# Altium schematic sheet PyNab_Motor&Encoders.SchDoc: PyNab - Motor & Ear Encoders
size A4; CompanyName: Enero; DrawnBy: Enero; Engineer: Hugo Balette-pape; Organization: ENERO; Address1: 7, rue ambroise thomas; Address2: 75009; Address3: Paris; Address4: France; Revision: 2.0; SheetNumber: 4; SheetTotal: 4
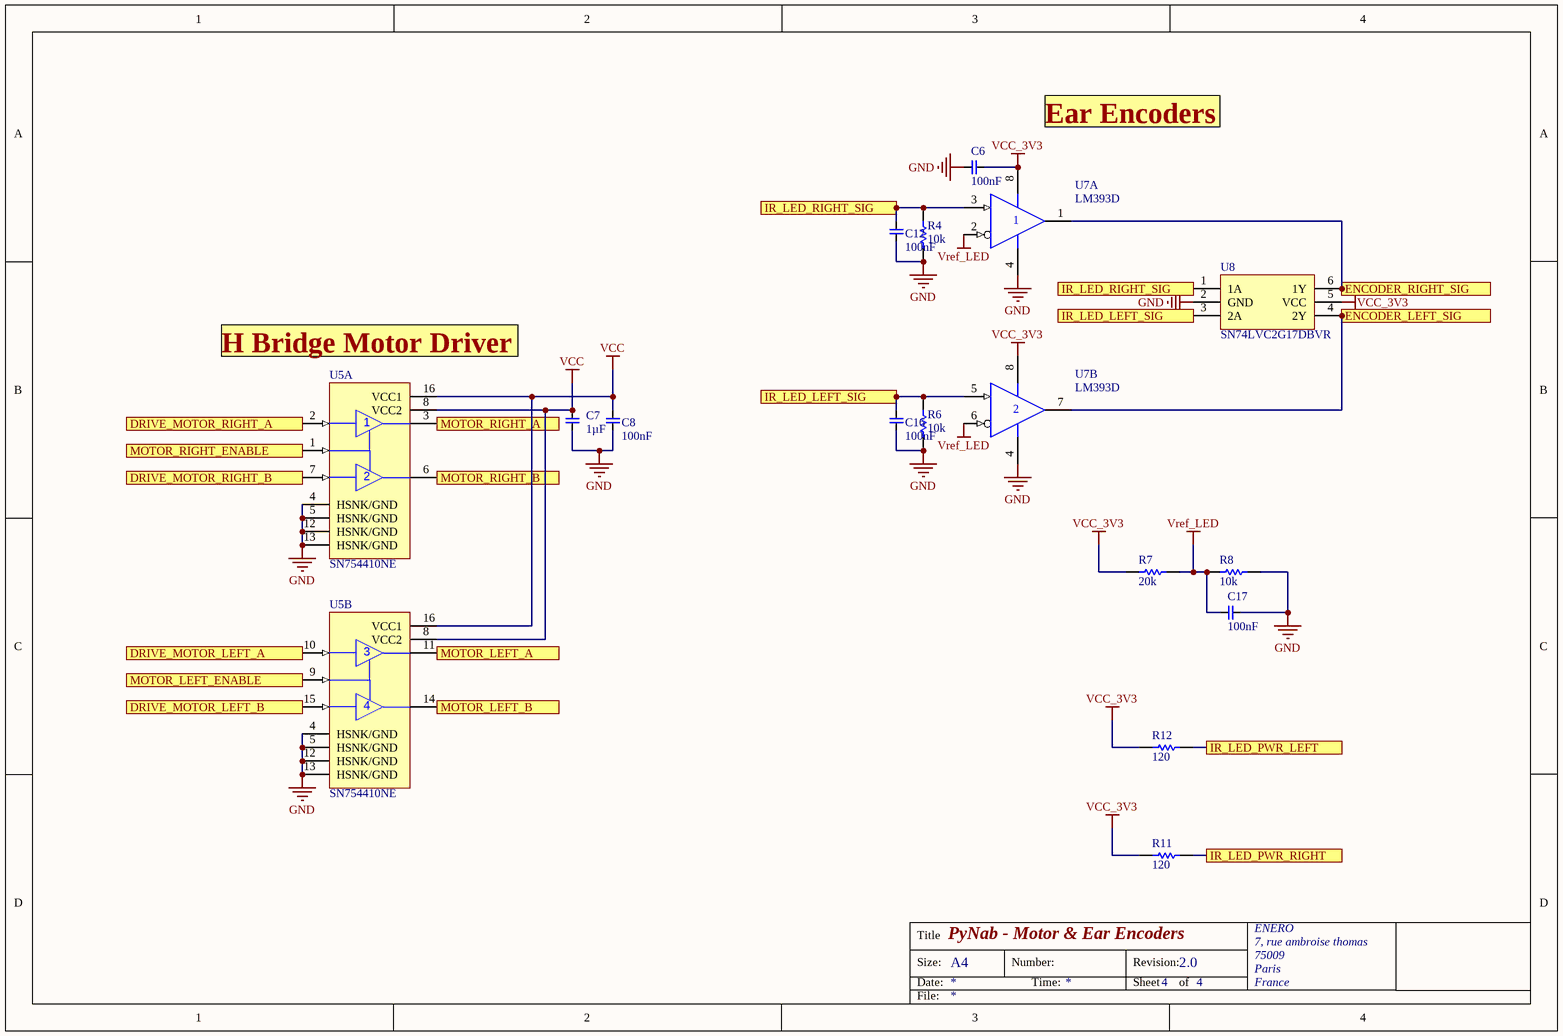
[diagram p0: PyNab_Motor&Encoders.SchDoc]

## Parts
C6  100nF  [CAP0603]
C7  1µF  [CAP0603]
C8  100nF  [CAP0603]
C12  100nF  [CAP0603]
C16  100nF  [CAP0603]
C17  100nF  [CAP0603]
R4  10k  [RES0603]
R6  10k  [RES0603]
R7  20k  [RES0603]
R8  10k  [RES0603]
R11  120  [RES0603]
R12  120  [RES0603]
U5  SN754410NE  [DIP16_traversant_support]  (parts A,B of 2)
U7  LM393D  [D008_N]  (parts A,B of 2)
U8  SN74LVC2G17DBVR  [SN74LVC2G17DBVR]

## Ports
DRIVE_MOTOR_LEFT_A, DRIVE_MOTOR_LEFT_B, DRIVE_MOTOR_RIGHT_A, DRIVE_MOTOR_RIGHT_B, ENCODER_LEFT_SIG, ENCODER_RIGHT_SIG, IR_LED_LEFT_SIG, IR_LED_PWR_LEFT, IR_LED_PWR_RIGHT, IR_LED_RIGHT_SIG, MOTOR_LEFT_A, MOTOR_LEFT_B, MOTOR_LEFT_ENABLE, MOTOR_RIGHT_A, MOTOR_RIGHT_B, MOTOR_RIGHT_ENABLE

## Nets
GND: C6.2 C7.1 C8.1 C12.1 C16.1 C17.2 R4.1 R6.1 R8.2 U5.4(HSNK/GND) U5.5(HSNK/GND) U5.12(HSNK/GND) U5.13(HSNK/GND) U7.4(GND) U8.2(GND)
VCC: C7.2 C8.2 U5.8(VCC2) U5.16(VCC1)
VCC_3V3: C6.1 R7.1 R11.1 R12.1 U7.8(VCC) U8.5(VCC)
Vref_LED: C17.1 R7.2 R8.1 U7.2(IN-) U7.6(IN-)
DRIVE_MOTOR_LEFT_A: U5.10(3A) ; port DRIVE_MOTOR_LEFT_A
DRIVE_MOTOR_LEFT_B: U5.15(4A) ; port DRIVE_MOTOR_LEFT_B
DRIVE_MOTOR_RIGHT_A: U5.2(1A) ; port DRIVE_MOTOR_RIGHT_A
DRIVE_MOTOR_RIGHT_B: U5.7(2A) ; port DRIVE_MOTOR_RIGHT_B
ENCODER_LEFT_SIG: U7.7(OUT) U8.4(2Y) ; port ENCODER_LEFT_SIG
ENCODER_RIGHT_SIG: U7.1(OUT) U8.6(1Y) ; port ENCODER_RIGHT_SIG
IR_LED_LEFT_SIG: C16.2 R6.2 U7.5(IN+) U8.3(2A) ; port IR_LED_LEFT_SIG
IR_LED_PWR_LEFT: R12.2 ; port IR_LED_PWR_LEFT
IR_LED_PWR_RIGHT: R11.2 ; port IR_LED_PWR_RIGHT
IR_LED_RIGHT_SIG: C12.2 R4.2 U7.3(IN+) U8.1(1A) ; port IR_LED_RIGHT_SIG
MOTOR_LEFT_A: U5.11(3Y) ; port MOTOR_LEFT_A
MOTOR_LEFT_B: U5.14(4Y) ; port MOTOR_LEFT_B
MOTOR_LEFT_ENABLE: U5.9(3,4EN) ; port MOTOR_LEFT_ENABLE
MOTOR_RIGHT_A: U5.3(1Y) ; port MOTOR_RIGHT_A
MOTOR_RIGHT_B: U5.6(2Y) ; port MOTOR_RIGHT_B
MOTOR_RIGHT_ENABLE: U5.1(1,2EN) ; port MOTOR_RIGHT_ENABLE

## Notes on the sheet
- Ear Encoders
- (near U5) H Bridge Motor Driver
- Title
- Size:
- Date:
- A4
- Number:
- Time:
- Revision:
- Sheet
- of
- File:

## Library data of the parts
C6-C8 C12 C16 C17 = Capacitor_np: Non-polarised capacitor
  C6 C8 C12 C16 C17: Value: 100nF
  C7: Value: 1µF
R4 R6-R8 R11 R12 = Resistor1: Resistor
  R4 R6 R8: Value: 10k
  R7: Value: 20k
  R11 R12: Value: 120
U5 = SN754410NE: Quadruple Half-H Driver; Published: 15-May-2002; LatestRevisionDate: 29-May-2009; LatestRevisionNote: Component Body Added.; DatasheetVersion: May-1990; PackageVersion: 1991; PackageReference: NE016; Publisher: Altium Limited; PackageDescription: DIP, 16-Pin, Row Spacing 7.62 mm, Pitch 2.54 mm; Code_JEDEC: MS-001-BB; ComponentLink1Description: Manufacturer Link; ComponentLink1URL: http://www.ti.com/; ComponentLink2Description: Datasheet; ComponentLink2URL: http://www-s.ti.com/sc/ds/sn754410.pdf
U7 = LM393D: Dual Differential Comparator; Published: 15-Apr-2002; LatestRevisionDate: 13-Apr-2006; LatestRevisionNote: IPC-7351 Footprint Added.; DatasheetVersion: Nov-1988; PackageVersion: Jan-1998; PackageReference: D008; Publisher: Altium Limited; PackageDescription: 8-Pin Small Outline Integrated Circuit 1.27 mm Pitch; Code_IPC: SOIC127P600-8; ComponentLink1Description: Manufacturer Link; ComponentLink1URL: http://www.ti.com/; ComponentLink2Description: Datasheet; ComponentLink2URL: http://www-s.ti.com/sc/ds/lm193.pdf